# Altium schematic sheet Rx_power.SchDoc: Balise IR-Rx - Power
size A3; Author: B Labbe; CompanyName: Oufffteam; DrawnBy: B Labbe; Engineer: B Labbe; Organization: Oufffteam; Address1: L3, 12a Rodborough Rd; Address2: Frenchs Forest; Address3: NSW; Address4: Australia 2086; Revision: B; SheetNumber: 4; SheetTotal: 5; DocumentName: Balise IR-Rx - Power
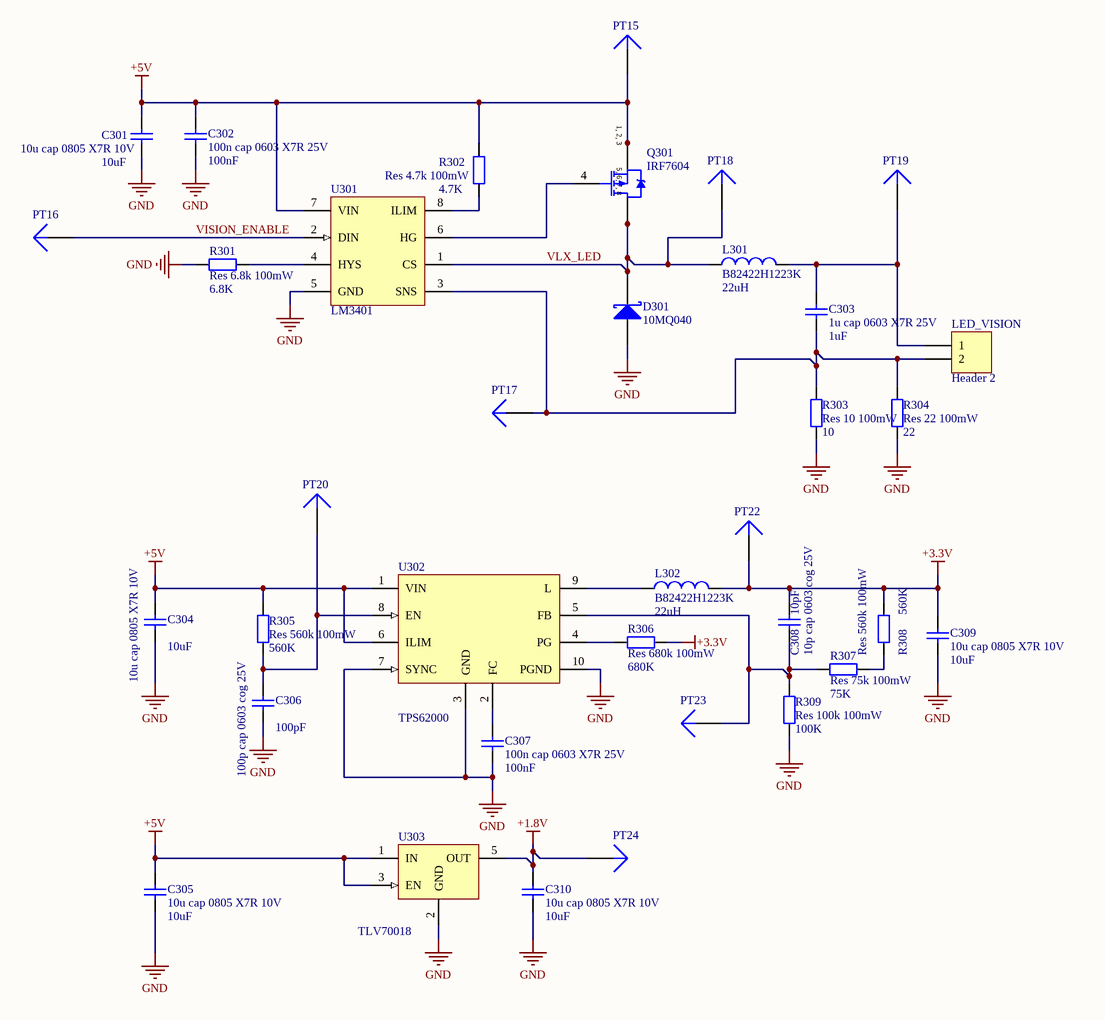
[diagram p0: Rx_power.SchDoc]

## Parts
C301  10u cap 0805 X7R 10V  value 10uF  [0805]
C302  100n cap 0603 X7R 25V  value 100nF  [0603]
C303  1u cap 0603 X7R 25V  value 1uF  [0603]
C304  10u cap 0805 X7R 10V  value 10uF  [0805]
C305  10u cap 0805 X7R 10V  value 10uF  [0805]
C306  100p cap 0603 cog 25V  value 100pF  [0603]
C307  100n cap 0603 X7R 25V  value 100nF  [0603]
C308  10p cap 0603 cog 25V  value 10pF  [0603]
C309  10u cap 0805 X7R 10V  value 10uF  [0805]
C310  10u cap 0805 X7R 10V  value 10uF  [0805]
D301  10MQ040  [D-64]
L301  B82422H1223K  value 22uH  [1210]
L302  B82422H1223K  value 22uH  [1210]
LED_VISION  Header 2  [HDR1X2]
PT15  Plug  [TP]  (value not drawn)
PT16  Plug  [TP]  (value not drawn)
PT17  Plug  [TP]  (value not drawn)
PT18  Plug  [TP]  (value not drawn)
PT19  Plug  [TP]  (value not drawn)
PT20  Plug  [TP]  (value not drawn)
PT22  Plug  [TP]  (value not drawn)
PT23  Plug  [TP]  (value not drawn)
PT24  Plug  [TP]  (value not drawn)
Q301  IRF7604  [Micro8]
R301  Res 6.8k 100mW  value 6.8K  [0603]
R302  Res 4.7k 100mW  value 4.7K  [0603]
R303  Res 10 100mW  value 10  [0603]
R304  Res 22 100mW  value 22  [0603]
R305  Res 560k 100mW  value 560K  [0603]
R306  Res 680k 100mW  value 680K  [0603]
R307  Res 75k 100mW  value 75K  [0603]
R308  Res 560k 100mW  value 560K  [0603]
R309  Res 100k 100mW  value 100K  [0603]
U301  LM3401  [MSOP8]
U302  TPS62000  [MS10]
U303  TLV70018  [SOT23-5]

## Nets
+1.8V: C310.2 PT24.1 U303.5(OUT)
+3.3V: C308.2 C309.2 L302.2 PT22.1 R306.2 R308.2
+5V: C301.2 C302.2 C304.2 C305.2 PT15.1 Q301.1(S) Q301.2(S) Q301.3(S) R302.2 R305.2 U301.7(VIN) U302.1(VIN) U302.6(ILIM) U303.1(IN) U303.3(EN)
GND: C301.1 C302.1 C304.1 C305.1 C306.1 C307.1 C309.1 C310.1 D301.1(A) R301.1 R303.1 R304.1 R309.1 U301.5(GND) U302.3(GND) U302.7(SYNC) U302.10(PGND) U303.2(GND)
VISION_ENABLE: PT16.1 U301.2(DIN)
VLX_LED: D301.2(K) L301.1 PT18.1 Q301.5(D) Q301.6(D) Q301.7(D) Q301.8(D) U301.1(CS)
NetC303_1: C303.1 LED_VISION.2 PT17.1 R303.2 R304.2 U301.3(SNS)
NetC303_2: C303.2 L301.2 LED_VISION.1 PT19.1
NetC306_2: C306.2 PT20.1 R305.1 U302.8(EN)
NetC307_2: C307.2 U302.2(FC)
NetC308_1: C308.1 PT23.1 R307.1 R309.2 U302.5(FB)
NetL302_1: L302.1 U302.9(L)
NetQ301_4: Q301.4(G) U301.6(HG)
NetR301_2: R301.2 U301.4(HYS)
NetR302_1: R302.1 U301.8(ILIM)
NetR306_1: R306.1 U302.4(PG)
NetR307_2: R307.2 R308.1

## Notes on the sheet
- Title
- Size:
- Date:
- A3
- Number:
- Time:
- Revision:
- Sheet
- of
- Oufffteam
- 3 place Carnot
- 26100
- Romans sur Isère
- oufffteam@gmail.com
- File:
- (in symbol IRF7604) 1, 2, 3; 5, 6, 7, 8

## Library data of the parts
C301-C310 = Cap: Capacitor; Published: 8-Jun-2000; LatestRevisionDate: 17-Jul-2002; LatestRevisionNote: Re-released for DXP Platform.; PackageReference: RAD-0.3; Publisher: Altium Limited
D301 = 10MQ040: Schottky Rectifier; Published: 8-Jun-2000; LatestRevisionDate: 17-Jul-2002; LatestRevisionNote: Re-released for DXP Platform.; DatasheetDocument: Dec-1997; PackageReference: D-64; Publisher: Altium Limited; ComponentLink1Description: Manufacturer Link; ComponentLink1URL: http://www.irf.com/; ComponentLink2Description: Datasheet; ComponentLink2URL: http://www.irf.com/product-info/datasheets/data/10mq040n.pdf
L301 L302 = Inductor: Code_IEC: 1005; Published: 8-Jun-2000; LatestRevisionDate: 17-Jul-2002; LatestRevisionNote: Re-released for DXP Platform.; PackageReference: 0402-A; Publisher: Altium Limited; Code_JEITA: 0402
LED_VISION = Header 2: Header, 2-Pin; LatestRevisionDate: 17-Jul-2002; LatestRevisionNote: Re-released for DXP Platform.; Publisher: Altium Limited
Q301 = IRF7604: HEXFET Power MOSFET; Published: 8-Jun-2000; LatestRevisionDate: 04-Mar-2005; LatestRevisionNote: Stylized 3D Model Added.; DatasheetVersion: Dec-1997; PackageReference: Micro8; Publisher: Altium Limited; PackageDescription: Shrink Small Outline; 8 Leads; Body Width 3 mm; Pitch 0.65 mm; ComponentLink1Description: Manufacturer Link; ComponentLink1URL: http://www.irf.com/; ComponentLink2Description: Datasheet; ComponentLink2URL: http://www.irf.com/product-info/datasheets/data/irf7604.pdf
R301-R309 = Res2: Resistor; Published: 8-Jun-2000; LatestRevisionDate: 17-Jul-2002; LatestRevisionNote: Re-released for DXP Platform.; PackageReference: AXIAL-0.4; Publisher: Altium Limited
U301 = LM3401: Hysteretic PFET Controller for High Power LED Drive
U302 = TPS6200x: HIGH-EFFICIENCY STEP-DOWN LOW POWER DC-DC CONVERTER
U303 = TLV700xx: 200-mA, Low-IQ, Low-Dropout Regulator for Portable Devices
PT15-PT20 PT22-PT24 = Plug: LatestRevisionDate: 17-Jul-2002; LatestRevisionNote: Re-released for DXP Platform.; Publisher: Altium Limited